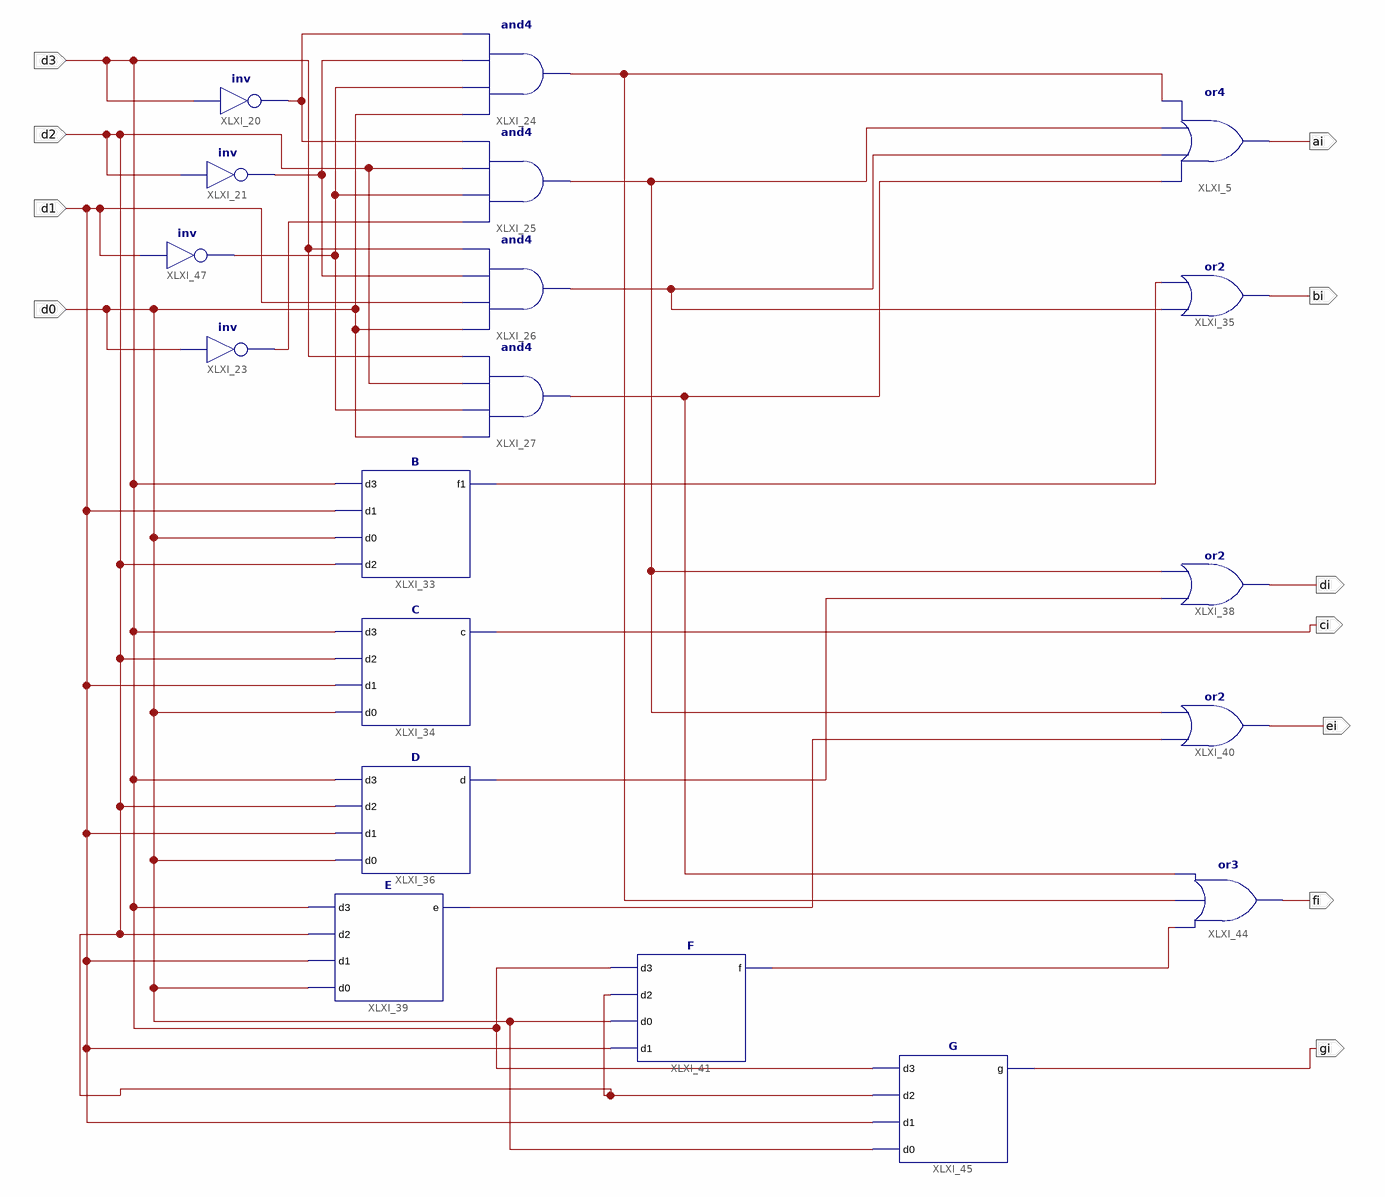
[diagram p0: schematic sheet 1]
// Xilinx ISE schematic bin_to_7seghex_sch.sch (spartan3e) as structural Verilog: 19 symbols, 11 ports
module bin_to_7seghex_sch (
  input  d3,
  input  d2,
  input  d1,
  input  d0,
  output ai,
  output bi,
  output ci,
  output di,
  output ei,
  output fi,
  output gi
);

  wire XLXN_54, XLXN_55, XLXN_57, XLXN_62, XLXN_73, XLXN_75, XLXN_78, XLXN_83, XLXN_85, XLXN_88, XLXN_101,
       XLXN_102;

  or XLXI_5 (ai, XLXN_83, XLXN_78, XLXN_75, XLXN_73);
  not XLXI_20 (XLXN_54, d3);
  not XLXI_21 (XLXN_55, d2);
  not XLXI_23 (XLXN_62, d0);
  and XLXI_24 (XLXN_73, d0, XLXN_57, XLXN_55, XLXN_54);
  and XLXI_25 (XLXN_75, XLXN_62, XLXN_57, d2, XLXN_54);
  and XLXI_26 (XLXN_78, d0, d1, XLXN_55, d3);
  and XLXI_27 (XLXN_83, d0, XLXN_57, d2, d3);
  B XLXI_33 (.d3(d3), .d1(d1), .d0(d0), .d2(d2), .f1(XLXN_85));
  C XLXI_34 (.d3(d3), .d2(d2), .d1(d1), .d0(d0), .c(ci));
  or XLXI_35 (bi, XLXN_78, XLXN_85);
  D XLXI_36 (.d3(d3), .d2(d2), .d1(d1), .d0(d0), .d(XLXN_101));
  or XLXI_38 (di, XLXN_101, XLXN_75);
  E XLXI_39 (.d3(d3), .d2(d2), .d1(d1), .d0(d0), .e(XLXN_102));
  or XLXI_40 (ei, XLXN_102, XLXN_75);
  F XLXI_41 (.d3(d3), .d2(d2), .d0(d0), .d1(d1), .f(XLXN_88));
  or XLXI_44 (fi, XLXN_88, XLXN_73, XLXN_83);
  G XLXI_45 (.d3(d3), .d2(d2), .d1(d1), .d0(d0), .g(gi));
  not XLXI_47 (XLXN_57, d1);
endmodule
